# EAGLE design Electromiografo (EAGLE 9.6.2)
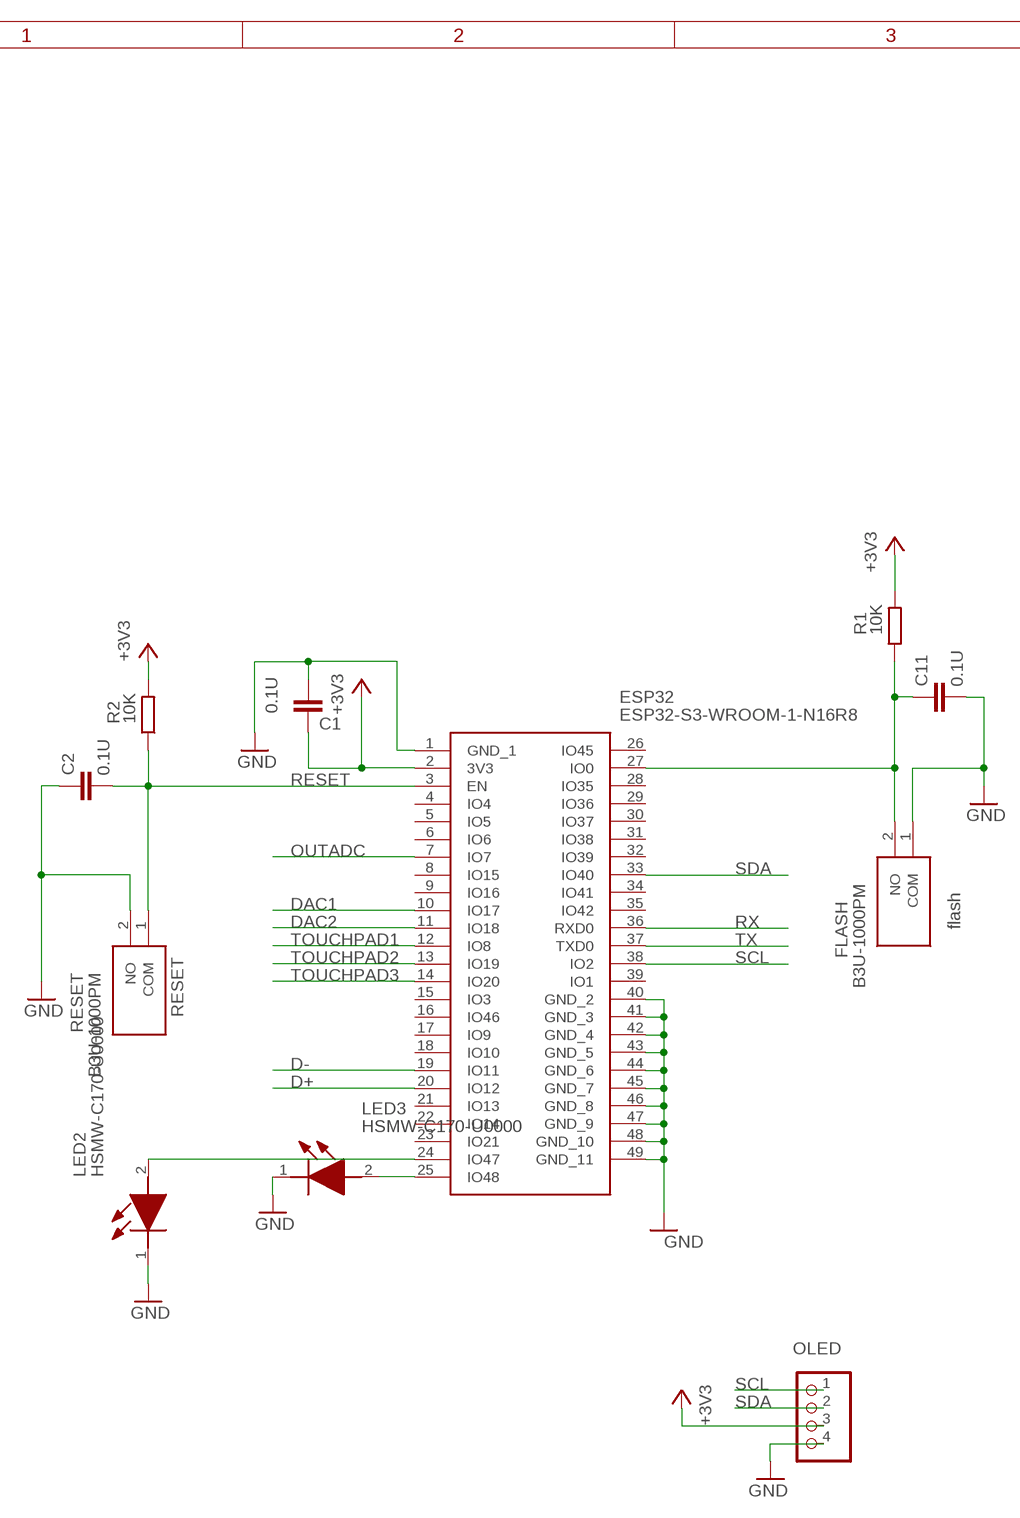
[diagram p0: schematic, sheet 1, part 1 of 2]
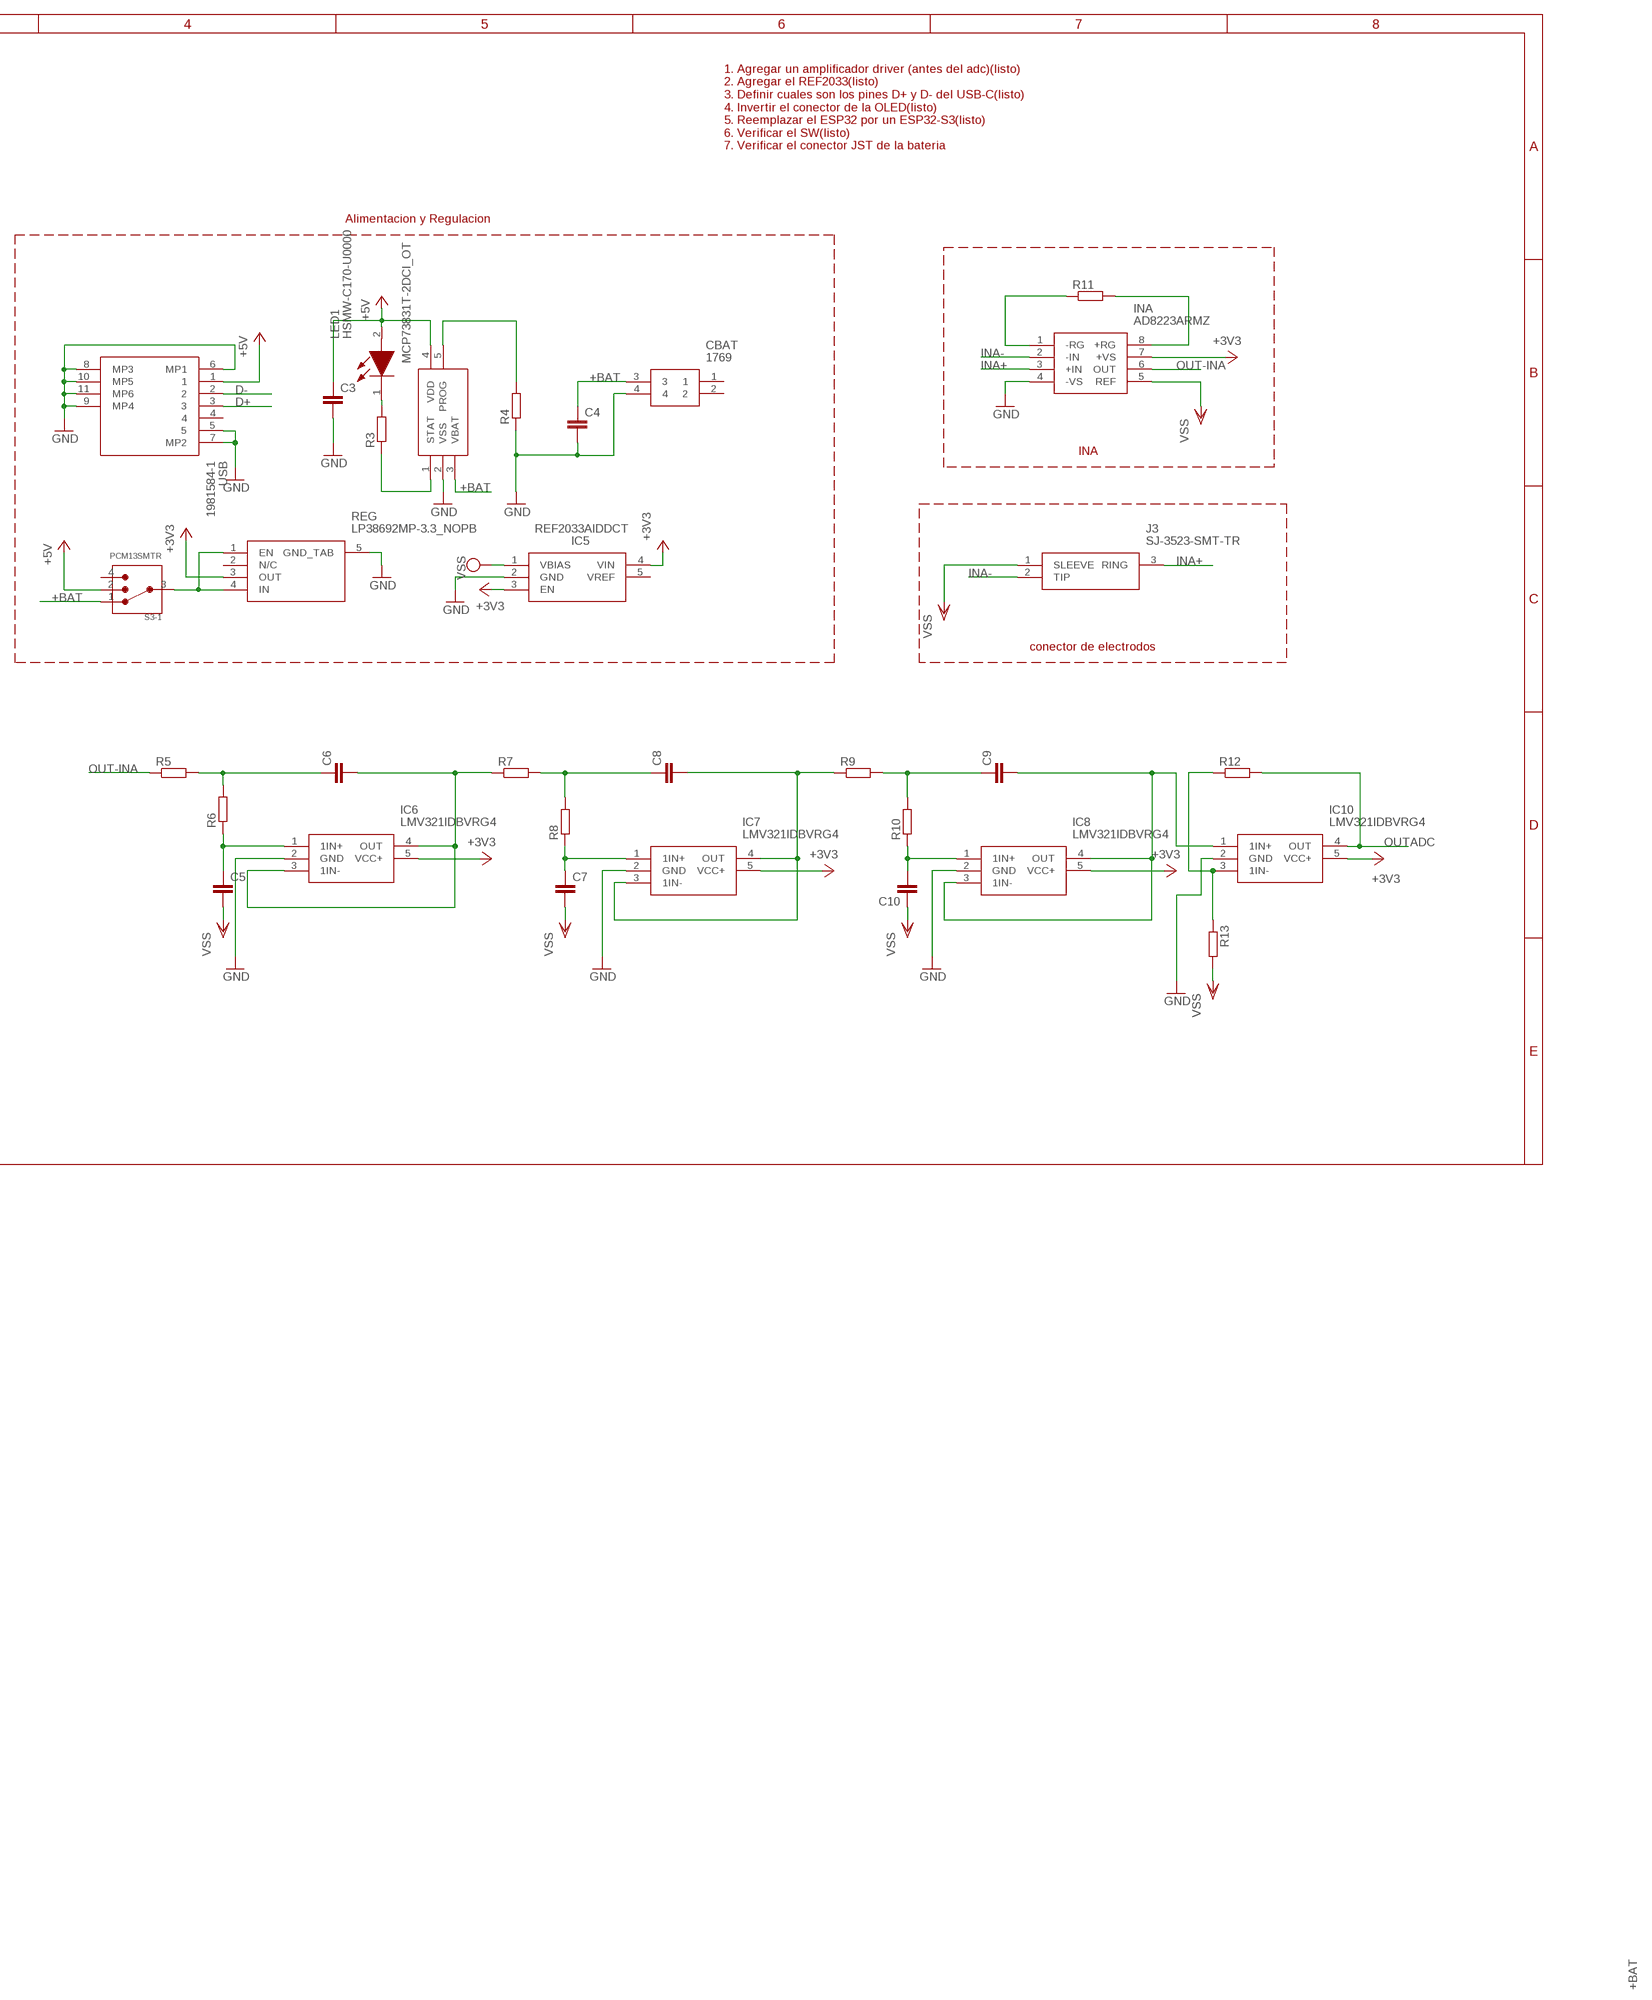
[diagram p1: schematic, sheet 1, part 2 of 2]

## Parts
C1  0.1U  C-EUC0603  [C0603]
C2  0.1U  C-EUC0603  [C0603]
C3  C-EUC0805  [C0805]
C4  C-EUC0805  [C0805]
C5  C-EUC0805  [C0805]
C6  C-EUC0805  [C0805]
C7  C-EUC0805  [C0805]
C8  C-EUC0805  [C0805]
C9  C-EUC0805  [C0805]
C10  C-EUC0805  [C0805]
C11  0.1U  C-EUC0603  [C0603]
CBAT  1769  [1769]
ESP32  ESP32-S3-WROOM-1-N16R8  [ESP32S3WROOM1N16R8]
FLASH  B3U-1000PM  [B3U1000PM]
IC2  MCP73831T-2DCI_OT  [SOT95P270X145-5N]
IC5  REF2033AIDDCT  [SOT95P280X110-5N]
IC6  LMV321IDBVRG4  [SOT95P280X145-5N]
IC7  LMV321IDBVRG4  [SOT95P280X145-5N]
IC8  LMV321IDBVRG4  [SOT95P280X145-5N]
IC10  LMV321IDBVRG4  [SOT95P280X145-5N]
INA  AD8223ARMZ  [SOP65P490X110-8N@1]
J3  SJ-3523-SMT-TR  [SJ3523SMTTR]
JP1  PINHD-1X4/90  [1X04/90]
LED1  HSMW-C170-U0000  [LEDC2012X90N]
LED2  HSMW-C170-U0000  [LEDC2012X90N]
LED3  HSMW-C170-U0000  [LEDC2012X90N]
R1  10K  R-EU_R0805  [R0805]
R2  10K  R-EU_R0805  [R0805]
R3  R-EU_R0805  [R0805]
R4  R-EU_R0805  [R0805]
R5  R-EU_R0805  [R0805]
R6  R-EU_R0805  [R0805]
R7  R-EU_R0805  [R0805]
R8  R-EU_R0805  [R0805]
R9  R-EU_R0805  [R0805]
R10  R-EU_R0805  [R0805]
R11  R-EU_R0805  [R0805]
R12  R-EU_R0805  [R0805]
R13  R-EU_R0805  [R0805]
REG  LP38692MP-3.3_NOPB  [SOT150P700X180-5N]
RESET  B3U-1000PM  [B3U1000PM]
S3-1  PCM13SMTR  [SW_PCM13SMTR]
USB  1981584-1  [19815841]

## Nets
+3V3: C1.2 ESP32.2(3V3) IC5.4(VIN) IC6.5(VCC+) IC7.5(VCC+) IC8.5(VCC+) IC10.5(VCC+) INA.7(+VS) JP1.3 R1.2 R2.2 REG.3(OUT)
+5V: C3.1 IC2.4(VDD) LED1.2(A) S3-1.2 USB.1
+BAT: C4.1 CBAT.3 IC2.3(VBAT) S3-1.1
D+: ESP32.20(IO12) USB.3
D-: ESP32.19(IO11) USB.2
DAC1: ESP32.10(IO17)
DAC2: ESP32.11(IO18)
GND: C1.1 C2.1 C3.2 C4.2 C11.2 CBAT.4 ESP32.1(GND_1) ESP32.40(GND_2) ESP32.41(GND_3) ESP32.42(GND_4) ESP32.43(GND_5) ESP32.44(GND_6) ESP32.45(GND_7) ESP32.46(GND_8) ESP32.47(GND_9) ESP32.48(GND_10) ESP32.49(GND_11) FLASH.1(COM) IC2.2(VSS) IC5.2(GND) IC6.2(GND) IC7.2(GND) IC8.2(GND) IC10.2(GND) INA.4(-VS) JP1.4 LED2.1(K) LED3.1(K) R4.1 REG.5(GND_TAB) RESET.2(NO) USB.5 USB.6(MP1) USB.7(MP2) USB.8(MP3) USB.9(MP4) USB.10(MP5) USB.11(MP6)
INA+: INA.3(+IN) J3.3(RING)
INA-: INA.2(-IN) J3.2(TIP)
N$1: C11.1 ESP32.27(IO0) FLASH.2(NO) R1.1
N$2: LED1.1(K) R3.2
N$3: ESP32.25(IO48) LED3.2(A)
N$4: ESP32.24(IO47) LED2.2(A)
N$5: IC5.3(EN) ; supply symbol labelled +3V3
N$17: IC10.3(1IN-) R12.1 R13.1
N$24: IC2.1(STAT) R3.1
N$25: IC2.5(PROG) R4.2
N$26: REG.1(EN) REG.4(IN) S3-1.3
N$30: C6.2 IC6.3(1IN-) IC6.4(OUT) R7.1
N$31: C6.1 R5.2 R6.2
N$32: C5.1 IC6.1(1IN+) R6.1
N$33: C9.1 R9.2 R10.2
N$34: C7.1 IC7.1(1IN+) R8.1
N$35: C8.1 R7.2 R8.2
N$36: C8.2 IC7.3(1IN-) IC7.4(OUT) R9.1
N$37: C10.2 IC8.1(1IN+) R10.1
N$38: C9.2 IC8.3(1IN-) IC8.4(OUT) IC10.1(1IN+)
N$40: INA.8(+RG) R11.2
N$41: INA.1(-RG) R11.1
OUT-INA: INA.6(OUT) R5.1
OUTADC: ESP32.7(IO7) IC10.4(OUT) R12.2
RESET: C2.2 ESP32.3(EN) R2.1 RESET.1(COM)
RX: ESP32.36(RXD0)
SCL: ESP32.38(IO2) JP1.1
SDA: ESP32.33(IO40) JP1.2
TOUCHPAD1: ESP32.12(IO8)
TOUCHPAD2: ESP32.13(IO19)
TOUCHPAD3: ESP32.14(IO20)
TX: ESP32.37(TXD0)
VSS: C5.2 C7.2 C10.1 IC5.1(VBIAS) INA.5(REF) J3.1(SLEEVE) R13.2
Unconnected: CBAT.1 CBAT.2 ESP32.4(IO4) ESP32.5(IO5) ESP32.6(IO6) ESP32.8(IO15) ESP32.9(IO16) ESP32.15(IO3) ESP32.16(IO46) ESP32.17(IO9) ESP32.18(IO10) ESP32.21(IO13) ESP32.22(IO14) ESP32.23(IO21) ESP32.26(IO45) ESP32.28(IO35) ESP32.29(IO36) ESP32.30(IO37) ESP32.31(IO38) ESP32.32(IO39) ESP32.34(IO41) ESP32.35(IO42) ESP32.39(IO1) IC5.5(VREF) REG.2(N/C) S3-1.4 USB.4

## Notes on the sheet
- 1. Agregar un amplificador driver (antes del adc)(listo)
  2. Agregar el REF2033(listo)
  3. Definir cuales son los pines D+ y D- del USB-C(listo)
  4. Invertir el conector de la OLED(listo)
  5. Reemplazar el ESP32 por un ESP32-S3(listo)
  6. Verificar el SW(listo)
- 7. Verificar el conector JST de la bateria
- Alimentacion y Regulacion
- INA
- flash
- conector de electrodos
- RESET
- OLED

## Library data of the parts
C1-C11 = rcl:C-EU: CAPACITOR, European symbol; SPICEPREFIX: C
CBAT = SamacSys_Parts:1769: Adafruit Accessories JST-PH 2-pin SMT Right Angle Connect Source: Datasheet <https://cdn-shop.adafruit.com/datasheets/17311.pdf>; DESCRIPTION: Adafruit Accessories JST-PH 2-pin SMT Right Angle Connect; HEIGHT: 5.5mm; MANUFACTURER_NAME: Adafruit; MANUFACTURER_PART_NUMBER: 1769; MOUSER_PART_NUMBER: 485-1769; MOUSER_PRICE-STOCK: https://www.mouser.co.uk/ProductDetail/Adafruit/1769?qs=GURawfaeGuBbgoGtf2XstA%3D%3D
ESP32 = SamacSys_Parts:ESP32-S3-WROOM-1-N16R8: Multiprotocol Modules SMD Module, ESP32-S3R8, 3.3V, 8 MB Octal PSRAM Die, 16 MB Quad SPI Flash, PCB Antenna Source: Datasheet <https://www.espressif.com/sites/default/files/documentation/esp32-s3-wroom-1_wroom-1u_datasheet_en.pdf>; DESCRIPTION: Multiprotocol Modules SMD Module, ESP32-S3R8, 3.3V, 8 MB Octal PSRAM Die, 16 MB Quad SPI Flash, PCB Antenna; HEIGHT: 3.25mm; MANUFACTURER_NAME: Espressif Systems; MANUFACTURER_PART_NUMBER: ESP32-S3-WROOM-1-N16R8; MOUSER_PART_NUMBER: 356-ESP32S3WRM1N16R8; MOUSER_PRICE-STOCK: https://www.mouser.co.uk/ProductDetail/Espressif-Systems/ESP32-S3-WROOM-1-N16R8?qs=Li%252BoUPsLEnvQc9gW6AMhZg%3D%3D
FLASH RESET = SamacSys_Parts:B3U-1000PM: SWITCH TACTILE SPST-NO 0.05A 12V, Tactile Switch SPST-NO Top Actuated Surface Mount Source: Datasheet <https://omronfs.omron.com/en_US/ecb/products/pdf/en-b3u.pdf>; DESCRIPTION: SWITCH TACTILE SPST-NO 0.05A 12V, Tactile Switch SPST-NO Top Actuated Surface Mount; HEIGHT: 1.75mm; MANUFACTURER_NAME: OMRON Electronic Components LLC; MANUFACTURER_PART_NUMBER: B3U-1000PM; MOUSER_PART_NUMBER: 653-B3U-1000PM; MOUSER_PRICE-STOCK: https://www.mouser.co.uk/ProductDetail/Omron-Electronics/B3U-1000PM?qs=hnUcNC2tU0oiJUWqjOlHqA%3D%3D
IC2 = SamacSys_Parts:MCP73831T-2DCI_OT: Charge Controller Li-Ion/Li-Pol Source: Datasheet <http://ww1.microchip.com/downloads/en/DeviceDoc/20001984g.pdf>; DESCRIPTION: Charge Controller Li-Ion/Li-Pol; HEIGHT: 1.45mm; MANUFACTURER_NAME: Microchip; MANUFACTURER_PART_NUMBER: MCP73831T-2DCI/OT; MOUSER_PART_NUMBER: 579-MCP73831T-2DCIOT; MOUSER_PRICE-STOCK: https://www.mouser.co.uk/ProductDetail/Microchip-Technology/MCP73831T-2DCI-OT?qs=yUQqVecv4qu38ml9qkvsJw%3D%3D
IC5 = SamacSys_Parts:REF2033AIDDCT: Low-Drift, Low-Power, Dual-Output VREF and VREF/2 Voltage Reference Source: Datasheet <http://www.ti.com/lit/gpn/ref2033>; DESCRIPTION: Low-Drift, Low-Power, Dual-Output VREF and VREF/2 Voltage Reference; HEIGHT: 1.1mm; MANUFACTURER_NAME: Texas Instruments; MANUFACTURER_PART_NUMBER: REF2033AIDDCT; MOUSER_PART_NUMBER: 595-REF2033AIDDCT; MOUSER_PRICE-STOCK: https://www.mouser.co.uk/ProductDetail/Texas-Instruments/REF2033AIDDCT?qs=7z%252BmIopC6%2FIc00c0wUqUCA%3D%3D
IC6-IC8 IC10 = SamacSys_Parts:LMV321IDBVRG4: Operational Amplifiers - Op Amps Sgl LowVltg Rail-to- Rail Output Op Amp Source: Datasheet <http://www.ti.com/lit/ds/symlink/lmv324.pdf>; DESCRIPTION: Operational Amplifiers - Op Amps Sgl LowVltg Rail-to- Rail Output Op Amp; HEIGHT: 1.45mm; MANUFACTURER_NAME: Texas Instruments; MANUFACTURER_PART_NUMBER: LMV321IDBVRG4; MOUSER_PART_NUMBER: 595-LMV321IDBVRG4; MOUSER_PRICE-STOCK: https://www.mouser.co.uk/ProductDetail/Texas-Instruments/LMV321IDBVRG4?qs=IUbkBnfnSQLdzBvwE%2Fn04A%3D%3D
INA = SamacSys_Parts:AD8223ARMZ: AD8223ARMZ, Instrumention Amplifier, 0.25mV Offset, 80dB CMRR, Rail-Rail Output, 5 to 18V, 8-Pin MSOP Source: Datasheet <https://datasheet.datasheetarchive.com/originals/distributors/Datasheets-SFU1/DSASFU10003811.pdf>; DESCRIPTION: AD8223ARMZ, Instrumention Amplifier, 0.25mV Offset, 80dB CMRR, Rail-Rail Output, 5 to 18V, 8-Pin MSOP; HEIGHT: 1.1mm; MANUFACTURER_NAME: Analog Devices; MANUFACTURER_PART_NUMBER: AD8223ARMZ; MOUSER_PART_NUMBER: 584-AD8223ARMZ; MOUSER_PRICE-STOCK: https://www.mouser.co.uk/ProductDetail/Analog-Devices/AD8223ARMZ?qs=%2FtpEQrCGXCxSDZZGI%252Btj8g%3D%3D
J3 = SamacSys_Parts:SJ-3523-SMT-TR: 3.5 mm, Stereo, Right Angle, Surface Mount (SMT), 3 Conductors, 0 Internal Switches, Audio Jack Connector Source: Datasheet <https://www.sameskydevices.com/product/resource/sj-352x-smt.pdf>; DESCRIPTION: 3.5 mm, Stereo, Right Angle, Surface Mount (SMT), 3 Conductors, 0 Internal Switches, Audio Jack Connector; HEIGHT: 5.2mm; MANUFACTURER_NAME: Same Sky; MANUFACTURER_PART_NUMBER: SJ-3523-SMT-TR; MOUSER_PART_NUMBER: 490-SJ-3523-SMT-TR; MOUSER_PRICE-STOCK: https://www.mouser.co.uk/ProductDetail/CUI-Devices/SJ-3523-SMT-TR?qs=WyjlAZoYn51zOHzJ3r4ZRA%3D%3D
JP1 = pinhead:PINHD-1X4: PIN HEADER
LED1-LED3 = SamacSys_Parts:HSMW-C170-U0000: BROADCOM LIMITED - HSMW-C170-U0000 - LED, WHITE, 670MCD, 0805 Source: Datasheet <https://componentsearchengine.com/Datasheets/2/HSMW-C170-U0000.pdf>; DESCRIPTION: BROADCOM LIMITED - HSMW-C170-U0000 - LED, WHITE, 670MCD, 0805; HEIGHT: 0.9mm; MANUFACTURER_NAME: Avago Technologies; MANUFACTURER_PART_NUMBER: HSMW-C170-U0000; MOUSER_PART_NUMBER: 630-HSMW-C170-U0000; MOUSER_PRICE-STOCK: https://www.mouser.co.uk/ProductDetail/Broadcom-Avago/HSMW-C170-U0000?qs=tMOYG%252Bw4%252BLwGyeHODzQdug%3D%3D
R1-R13 = rcl:R-EU_: RESISTOR, European symbol; SPICEPREFIX: R
REG = SamacSys_Parts:LP38692MP-3.3_NOPB: LP38692MP-3.3/NOPB, Low Dropout Voltage Regulator, 1A, 3.3 V +/-2.5%, 2.7 10 Vin, 5-Pin SOT-223 Source: Datasheet <http://www.ti.com/lit/ds/symlink/lp38692.pdf>; DESCRIPTION: LP38692MP-3.3/NOPB, Low Dropout Voltage Regulator, 1A, 3.3 V +/-2.5%, 2.7 10 Vin, 5-Pin SOT-223; HEIGHT: 1.8mm; MANUFACTURER_NAME: Texas Instruments; MANUFACTURER_PART_NUMBER: LP38692MP-3.3/NOPB; MOUSER_PART_NUMBER: 926-LP38692MP3.3NOPB; MOUSER_PRICE-STOCK: https://www.mouser.co.uk/ProductDetail/Texas-Instruments/LP38692MP-3.3-NOPB?qs=1FNqv8aZn1TpKuOP2NKBdg%3D%3D
S3-1 = PCM13SMTR:PCM13SMTR: Check availability <https://pricing.snapeda.com/parts/PCM13SMTR/C%26K/view-part?ref=eda>; AVAILABILITY: In Stock; CHECK_PRICES: https://www.snapeda.com/parts/PCM13SMTR/C%2526K/view-part/?ref=eda; DESCRIPTION: Slide Switch SP3T Surface Mount, Right Angle; MF: C&K; MP: PCM13SMTR; PACKAGE: None; PRICE: None; SNAPEDA_LINK: https://www.snapeda.com/parts/PCM13SMTR/C%2526K/view-part/?ref=snap
USB = SamacSys_Parts:1981584-1: A/B, 2.0, Micro Profile, Receptacle, 1 Port, Top, Right Angle, Tape & Reel, Offset, Surface Mount, Cable-to-Board, 5 Position, USB Connectors Source: Datasheet <https://www.te.com/commerce/DocumentDelivery/DDEController?Action=srchrtrv&DocNm=1981584&DocType=Customer Drawing&DocLang=English&DocFormat=pdf&PartCntxt=1981584-1>; DESCRIPTION: A/B, 2.0, Micro Profile, Receptacle, 1 Port, Top, Right Angle, Tape & Reel, Offset, Surface Mount, Cable-to-Board, 5 Position, USB Connectors; HEIGHT: 3.2mm; MANUFACTURER_NAME: TE Connectivity; MANUFACTURER_PART_NUMBER: 1981584-1; MOUSER_PART_NUMBER: 571-1981584-1; MOUSER_PRICE-STOCK: https://www.mouser.co.uk/ProductDetail/TE-Connectivity/1981584-1?qs=ozkTL%2FUej0TLYxjQLPnd2Q%3D%3D

## Board
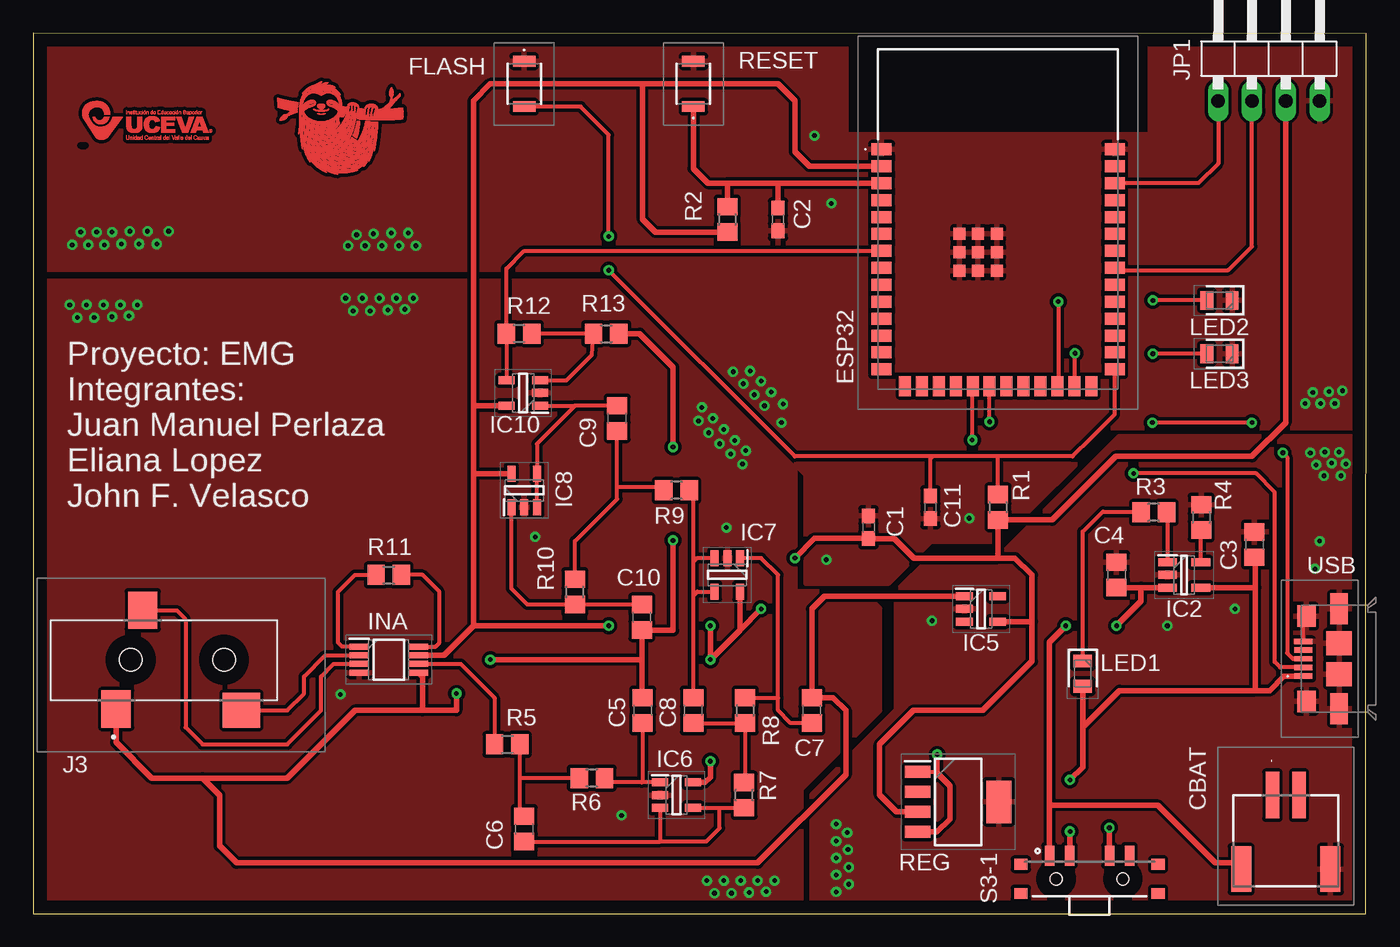
[diagram p2: board, top side]
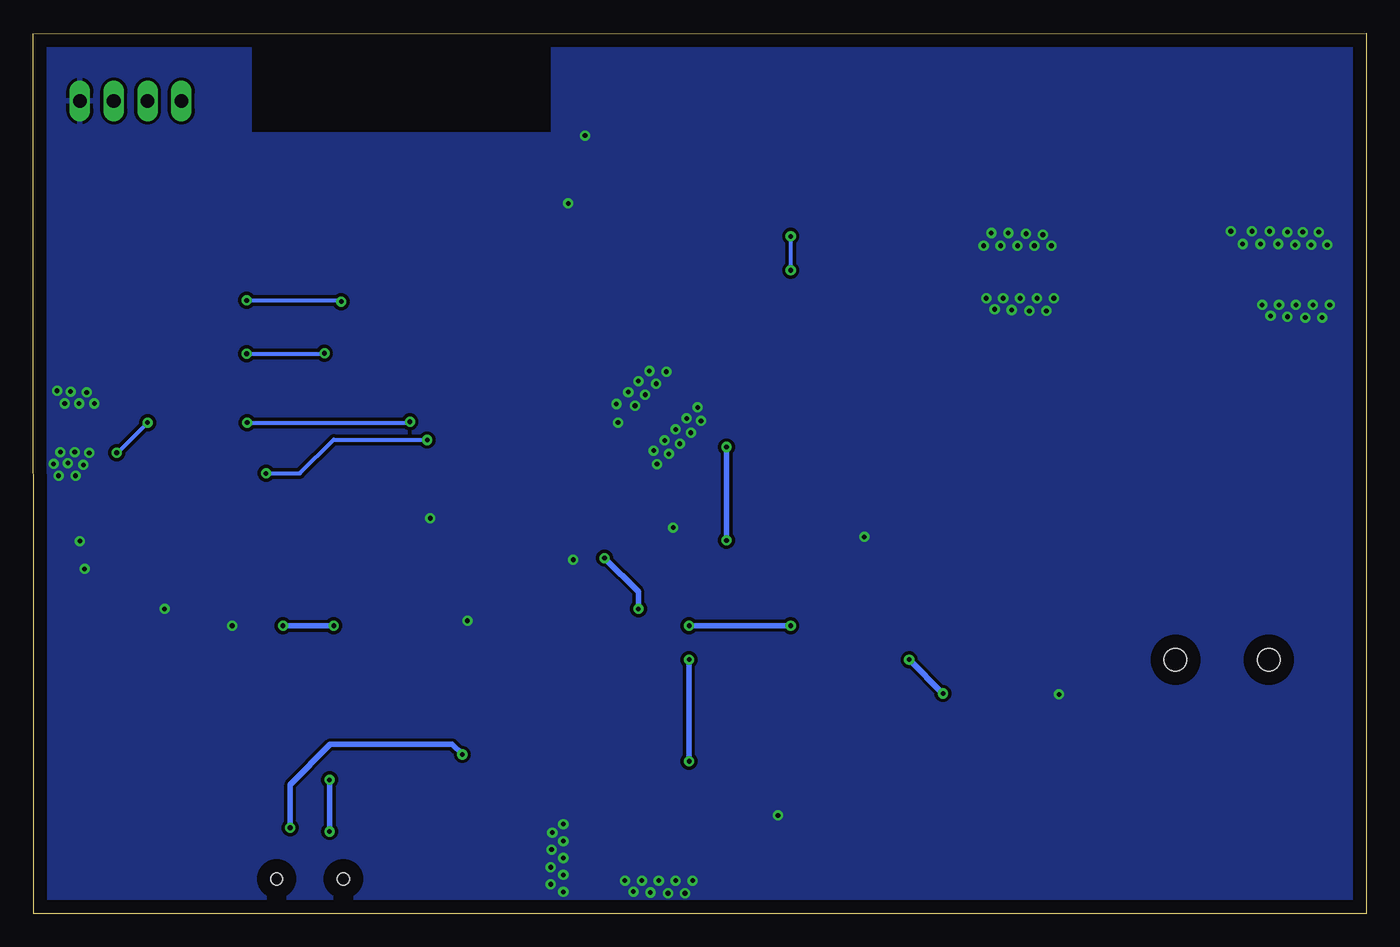
[diagram p3: board, bottom side, seen from below]

Size 100.01 x 66.03 mm. Coordinates in mm from the lower left corner, seen from the top.
Outline: 0,0 99.97,0 100.01,65.99 0,66.03 0,0
Copper layers (1*16): Top 0.035mm / dielectric 1.5mm / Bottom 0.035mm
Design rules "default": minimum track width 6mil, minimum drill 0.35mm, track to track 6mil, track to pad 6mil, pad to pad 6mil, via to via 6mil, smd to smd 6mil, copper to edge 40mil, drill to drill 6mil, minimum pad ring 10mil, minimum via ring 8mil, stop-mask expansion 4mil, vias tented up to drill 0mil, thermal gap 10mil

### Footprints (pad centres in the part's own frame; a part is rotated, then mirrored left to right if it is on the bottom)
C0603 = smd 1.1 x 1: 1 -0.85,0; 2 0.85,0
C0805 = smd 1.3 x 1.5: 1 -0.95,0; 2 0.95,0
1769 = smd 1 x 3.5: 1 -1,0; 2 1,0 | smd 1.5 x 3.4: 3 -3.35,-5.55; 4 3.35,-5.55
ESP32S3WROOM1N16R8 = smd 1.5 x 0.9: 1 -8.75,5.26; 2 -8.75,3.99; 3 -8.75,2.72; 4 -8.75,1.45; 5 -8.75,0.18; 6 -8.75,-1.09; 7 -8.75,-2.36; 8 -8.75,-3.63; 9 -8.75,-4.9; 10 -8.75,-6.17; 11 -8.75,-7.44; 12 -8.75,-8.71; 13 -8.75,-9.98; 14 -8.75,-11.25; 27 8.75,-11.25; 28 8.75,-9.98; 29 8.75,-8.71; 30 8.75,-7.44; 31 8.75,-6.17; 32 8.75,-4.9; 33 8.75,-3.63; 34 8.75,-2.36; 35 8.75,-1.09; 36 8.75,0.18; 37 8.75,1.45; 38 8.75,2.72; 39 8.75,3.99; 40 8.75,5.26 | smd 0.9 x 1.5: 15 -6.985,-12.5; 16 -5.715,-12.5; 17 -4.445,-12.5; 18 -3.175,-12.5; 19 -1.905,-12.5; 20 -0.635,-12.5; 21 0.635,-12.5; 22 1.905,-12.5; 23 3.175,-12.5; 24 4.445,-12.5; 25 5.715,-12.5; 26 6.985,-12.5 | smd 0.9 x 0.9: 41 -1.5,-2.46; 42 -2.9,-1.06; 43 -2.9,-2.46; 44 -2.9,-3.86; 45 -1.5,-3.86; 46 -0.1,-3.86; 47 -0.1,-2.46; 48 -0.1,-1.06; 49 -1.5,-1.06
B3U1000PM = smd 0.8 x 1.7: 1 1.7,0; 2 -1.7,0
SOT95P270X145-5N = smd 1.4 x 0.6: 1 -1.25,0.95; 2 -1.25,0; 3 -1.25,-0.95; 4 1.25,-0.95; 5 1.25,0.95
SOT95P280X110-5N = smd 1.25 x 0.6: 1 -1.25,0.95; 2 -1.25,0; 3 -1.25,-0.95; 4 1.25,-0.95; 5 1.25,0.95
SOT95P280X145-5N = smd 1.2 x 0.6: 1 -1.25,0.95; 2 -1.25,0; 3 -1.25,-0.95; 4 1.25,-0.95; 5 1.25,0.95
SOP65P490X110-8N@1 = smd 1.45 x 0.45: 1 -2.225,0.975; 2 -2.225,0.325; 3 -2.225,-0.325; 4 -2.225,-0.975; 5 2.225,-0.975; 6 2.225,-0.325; 7 2.225,0.325; 8 2.225,0.975
SJ3523SMTTR = smd 2.2 x 2.8: 1 2.4,-3.7; 3 4.4,3.7 | smd 2.8 x 2.6: 2 11.8,-3.8 | hole 1.7: 3.5,0; 10.5,0
1X04/90 = drill 1.016 long: 1 -3.81,-3.81; 2 -1.27,-3.81; 3 1.27,-3.81; 4 3.81,-3.81
LEDC2012X90N = smd 0.95 x 1.4: 1 -0.95,0; 2 0.95,0
R0805 = smd 1.3 x 1.5: 1 -0.95,0; 2 0.95,0
SOT150P700X180-5N = smd 1.9 x 0.9: 1 -3.05,2.25; 2 -3.05,0.75; 3 -3.05,-0.75; 4 -3.05,-2.25 | smd 1.9 x 3.2: 5 3.05,0
SW_PCM13SMTR = smd 0.7 x 1.5: 1 -3,1.75; 2 -1.5,1.75; 3 1.5,1.75; 4 3,1.75 | smd 1 x 0.8: P$1 -5.15,1.1; P$2 -5.15,-1.1; P$3 5.15,1.1; P$4 5.15,-1.1 | hole 0.9: -2.5,0; 2.5,0
19815841 = smd 0.4 x 1.35: 1 -1.3,2.675; 2 -0.65,2.675; 3 0,2.675; 4 0.65,2.675; 5 1.3,2.675 | smd 1.6 x 1.4: 6 -3.2,2.45; 7 3.2,2.45 | smd 2.3 x 1.3: 8 -3.75,0; 11 3.75,0 | smd 1.8 x 1.9: 9 -1.15,0; 10 1.15,0

### Placement (x,y rotation side)
C1  62.67,28.98 270 top
C2  55.88,52.07 90 top
C3  91.63,27.69 90 top
C4  81.28,25.4 90 top
C5  45.72,15.24 90 top
C6  36.83,6.35 270 top
C7  58.42,15.24 90 top
C8  49.53,15.24 90 top
C9  43.8,37.15 90 top
C10  45.66,22.23 90 top
C11  67.31,30.48 270 top
CBAT  93.98,8.89 0 top
ESP32  72.39,52.07 0 top
FLASH  36.83,62.23 90 top
IC2  86.36,25.4 0 top
IC5  71.12,22.86 0 top
IC6  48.26,8.89 0 top
IC7  52.07,25.4 270 top
IC8  36.83,31.75 90 top
IC10  36.77,39.05 180 top
INA  26.67,19.05 0 top
J3  3.81,19.05 0 top
JP1  92.71,64.77 0 top
LED1  78.75,18 270 top
LED2  89,46 180 top
LED3  89,42 180 top
R1  72.39,30.48 270 top
R2  52.07,52.07 270 top
R3  84.07,30.1 180 top
R4  87.63,29.72 270 top
R5  35.56,12.7 0 top
R6  41.91,10.16 180 top
R7  53.34,8.89 90 top
R8  53.4,15.24 270 top
R9  48.26,31.75 180 top
R10  40.64,24.13 90 top
R11  26.67,25.4 0 top
R12  36.45,43.5 180 top
R13  42.99,43.5 0 top
REG  69.41,8.38 0 top
RESET  49.53,62.23 270 top
S3-1  79.25,2.6 0 top
USB  97.98,19.11 90 top

### Tracks (layer width: path | path; a pad name or v marks a point on that pad's centre or on a via)
+3V3  (via drill 0.35)
  Top 0.305: R1.2
  Top 0.406: INA.7 30.8,19.38 33.02,21.59 | 33.02,21.59 33.02,33.02 | 33.02,33.02 33.02,38.1 | IC5.4 74.93,21.91 | REG.3 64.77,7.63 63.5,8.9 63.5,12.7 66.04,15.24 71.25,15.24 74.93,18.92 74.93,21.91 | ESP32.2 62.05,56.06 58.67,56.07 58.23,56.07 57.15,57.15 57.15,60.96 55.88,62.23 45.72,62.23 | 45.72,62.23 34.29,62.23 33.02,60.96 33.02,38.1 | R2.2 46.67,51.12 45.72,52.07 45.72,62.23 | IC6.5 50.4,9.84 50.8,10.24 v50.8,11.43 | 53.02,21.27 v50.8,19.05 v50.8,21.59 | 53.02,21.27 v54.61,22.86 | IC7.5 53.02,21.27 | v57.15,26.67 58.63,28.15 62.65,28.15 C1.2 64.61,28.13 66.07,26.67 72.39,26.67 | 74.93,21.91 74.93,25.4 73.66,26.67 72.39,26.67 | R1.2 72.39,26.67 | IC8.5 33.04,33 33.02,33.02 | JP1.3 93.98,36.83 91.44,34.29 81.22,34.29 76.45,29.53 R1.2 | 33.02,21.59 v43.18,21.59 | 33.02,38.1 IC10.5
  Bottom 0.406: v50.8,11.43 v50.8,19.05 | v54.61,22.86 54.61,24.13 v57.15,26.67 | v43.18,21.59 v50.8,21.59
+5V  (via drill 0.35)
  Top 0.406: USB.1 93.84,17.81 92.76,16.73 91.66,16.73 | v77.78,10.04 78.74,10.99 78.74,13.97 | 78.74,13.97 81.5,16.73 91.66,16.73 | 91.69,24.45 91.69,16.76 91.66,16.73 | v77.79,6.16 77.79,4.39 S3-1.2 | IC2.4 91.69,24.45 | C3.1 91.69,26.67 91.69,24.45 | 78.74,13.97 LED1.2
  Bottom 0.406: v77.78,10.04 v77.78,6.16 v77.79,6.16
+BAT  (via drill 0.35)
  Top 0.305: IC2.3 85.59,24.45
  Top 0.406: C4.1 83.12,24.45 | 83.12,24.45 IC2.3 | 76.25,8.14 76.25,20.37 v77.47,21.59 | 90.16,3.81 90.17,3.81 | 90.17,3.81 CBAT.3 | 90.17,3.81 88.71,3.81 84.39,8.13 76.26,8.13 76.25,8.14 | 76.25,8.14 S3-1.1 | 83.12,24.45 83.12,23.43 v81.28,21.59
  Bottom 0.406: v81.28,21.59 v77.47,21.59
D+  (via drill 0.35)
  Top 0.305: v93.76,34.58 94.09,34.24 94.09,19.54 94.52,19.11 USB.3 | v91.44,36.83 v83.96,36.83 | v71.75,36.89 ESP32.20
  Bottom 0.305: v93.76,34.58 93.69,34.58 v91.44,36.83 | v83.96,36.83 71.82,36.83 v71.75,36.89
D-  (via drill 0.35)
  Top 0.305: USB.2 93.57,18.46 93.15,18.88 93.15,31.62 91.76,33.02 v82.55,33.02 | v70.45,35.53 70.45,39.54 ESP32.19
  Bottom 0.305: v82.55,33.02 80.01,33.02 77.47,35.56 70.55,35.56 70.48,35.5 v70.45,35.53
GND  (via drill 0.35)
  Top 0.152: ESP32.40 80.96,57.15
  Top 0.305: 95.35,20.46 USB.5 95.31,22.09 USB.7
  other vias: 85.09,21.59 90.17,22.86 67.44,21.97 70.23,29.65 59.5,26.54 52.01,28.96 44.13,7.37 37.66,28.26 23.05,16.45 2.73,45.66 4,45.66 5.27,45.66 6.54,45.66 7.81,45.66 3.3,44.7 4.57,44.7 5.91,44.77 7.18,44.83 59.88,53.28 58.61,58.36 96.52,27.94 3.56,51.12 4.76,51.12 5.91,51.12 7.24,51.18 8.57,51.18 10.16,51.18 9.27,50.23 7.94,50.23 6.6,50.23 5.33,50.16 4.13,50.16 2.92,50.16 50.16,37.97 50.99,37.15 51.82,36.32 52.64,35.5 53.47,34.73 49.91,36.96 50.67,36.07 51.5,35.24 52.32,34.48 53.21,33.72 52.51,40.64 53.28,39.75 54.1,38.93 54.86,38.1 56.13,36.83 53.78,40.7 54.61,39.94 55.37,39.12 56.26,38.23 95.44,38.27 96.58,38.27 97.66,38.27 96.01,39.09 97.21,39.16 98.23,39.22 95.82,34.56 96.91,34.62 97.99,34.62 96.26,33.66 97.42,33.79 98.49,33.73 96.84,32.84 98.11,32.84 23.43,46.16 24.7,46.16 25.97,46.16 27.24,46.16 28.51,46.16 24,45.21 25.27,45.21 26.61,45.28 27.88,45.34 28.7,50.1 27.43,50.1 26.16,50.1 24.89,50.1 23.62,50.1 28.13,51.05 26.86,51.05 25.53,50.99 24.26,50.93 60.24,1.63 60.24,2.9 60.24,4.17 60.24,5.44 60.24,6.71 61.2,2.2 61.2,3.47 61.13,4.81 61.07,6.08 50.54,2.48 51.81,2.48 53.08,2.48 54.35,2.48 55.62,2.48 51.11,1.52 52.38,1.52 53.72,1.59 54.99,1.65 96.17,25.86
  pour Top (isolate 0.254): 99.95,36.46 99.95,65.99 83.82,65.99 83.82,58.42 60.96,58.42 60.96,66.04 0,66.04 0,48.34 42.59,48.34 57.98,32.96 57.98,24.77 64.14,24.77 67.31,27.94 72.39,27.94 80.91,36.46
  pour Top (isolate 0.254): 0,47.44 43.04,47.44 57.15,33.34 57.15,24.13 62.23,24.13 63.5,22.86 63.5,15.24 57.62,9.36 57.62,0 0,0
  pour Top (isolate 0.254): 81.5,35.78 100.33,35.78 100.33,0 58.42,0 58.42,8.89 64.77,15.24 64.77,24.13 67.31,26.67 72.39,26.67
  pour Bottom (isolate 0.254): 0,66.04 60.96,66.04 60.96,58.42 83.82,58.42 83.82,65.98 99.89,65.98 99.89,-0.05 0,-0.05
INA+
  Top 0.305: J3.3 10.75,22.75 11.43,22.07 11.43,13.97 12.7,12.7 19.05,12.7 21.59,15.24 21.59,17.78 22.54,18.73 INA.3
INA-
  Top 0.305: J3.2 19.04,15.25 19.06,15.25 20.32,16.51 20.32,17.78 21.91,19.38 INA.2
N$1  (via drill 0.35)
  Top 0.305: R1.1 72.39,34.29 | C11.1 67.31,34.12 67.48,34.29 | 72.39,34.29 77.98,34.29 79.34,35.66 79.38,35.69 81.14,37.45 ESP32.27 | 72.39,34.29 67.48,34.29 | 67.48,34.29 57.15,34.29 v43.18,48.26 | v43.18,50.8 43.18,58.42 41.07,60.53 FLASH.2
  Bottom 0.305: v43.18,48.26 v43.18,50.8
N$2
  Top 0.305: LED1.1 78.75,23 78.75,23.31 78.75,28.64 80.26,30.16 83.06,30.16
  Top 0.406: 83.06,30.16 R3.2
N$3  (via drill 0.35)
  Top 0.305: LED3.2 v84,42 | v78.17,42.04 78.11,41.97 ESP32.25
  Bottom 0.305: v84,42 78.21,42 v78.17,42.04
N$4  (via drill 0.35)
  Top 0.305: LED2.2 v84,46 | v76.9,45.9 76.9,39.64 ESP32.24
  Bottom 0.305: v84,46 76.99,46 v76.9,45.91 v76.9,45.9
N$17
  Top 0.305: R13.1 41.59,43.18 | R13.1 R12.1 | IC10.3 40,40 41.91,41.91 R13.1
N$24
  Top 0.305: IC2.1 85.09,26.37 85.09,30.03 R3.1
N$25
  Top 0.305: IC2.5 87.61,28.75 R4.2
N$26  (via drill 0.35)
  Top 0.305: REG.1 67.73,10.63
  Top 0.406: REG.4 67.82,6.13 68.77,7.08 68.77,9.59 67.73,10.63 67.82,10.72 v67.82,11.94 | S3-1.3 80.75,6.39 80.77,6.41 v80.74,6.45
  Bottom 0.406: v80.74,6.45 80.74,9.68 77.72,12.7 68.58,12.7 v67.82,11.94
N$30
  Top 0.305: 49.53,7.92 IC6.4 51.5,7.94 | 47.01,5.4 50.48,5.4 51.5,6.41 51.5,7.94 | 37.15,5.08 C6.2 47.01,5.4 | IC6.3 47.01,5.4 | 51.5,7.94 R7.1
N$31
  Top 0.305: C6.1 36.51,7.62 36.51,10.16 | 36.51,10.16 R5.2 | R6.2 36.51,10.16
N$32
  Top 0.305: IC6.1 45.66,9.84 | 45.66,9.84 43.18,9.84 R6.1 | C5.1 45.72,9.9 45.66,9.84
N$33
  Top 0.305: R10.2 40.64,27.94 43.8,31.1 43.8,32 | 43.8,32 C9.1 | R9.2 47.06,32 43.8,32
N$34
  Top 0.305: 55.88,16.19 55.88,25.4 54.61,26.67 53.04,26.67 IC7.1 | C7.1 56.83,14.29 55.88,15.24 55.88,16.19 | R8.1 55.88,16.19
N$35
  Top 0.305: R7.2 53.4,9.9 R8.2 C8.1 49.85,13.97
N$36
  Top 0.305: C8.2 49.53,23.86 | IC7.4 49.82,24.15 49.53,23.86 | IC7.3 49.78,26.65 49.53,26.4 | 49.53,23.86 49.53,26.4 | 49.53,26.4 49.53,31.43 R9.1
N$37
  Top 0.305: C10.2 44.45,23.18 44.39,23.18 R10.1 37.08,23.18 35.88,24.38 IC8.1
N$38
  Top 0.305: IC8.3 IC8.4 37.78,35.24 40.64,38.1 | 40.64,38.1 C9.2 | 40.64,38.1 | IC10.1 40.64,38.1
N$40
  Top 0.305: INA.8 30.18,20.02 30.48,20.32 30.48,24.13 29.21,25.4 R11.2
N$41
  Top 0.305: INA.1 23.16,20.02 22.86,20.32 22.86,24.13 24.13,25.4 R11.1
OUT-INA
  Top 0.305: INA.6 32.08,18.73 34.61,16.19 R5.1
OUTADC
  Top 0.305: ESP32.7 36.83,49.71 35.5,48.38 R12.2 35.52,43.48 IC10.4
RESET
  Top 0.406: ESP32.3 55.88,54.8 | 55.88,54.8 C2.2 | RESET.1 49.53,55.88 50.61,54.8 52.07,54.8 | 52.07,54.8 R2.1 | 55.88,54.8 52.07,54.8
SCL
  Top 0.305: ESP32.38 87.43,54.79 88.9,56.26 JP1.1
SDA
  Top 0.305: ESP32.33 81.32,48.26 89.66,48.26 91.44,50.04 JP1.2
VSS  (via drill 0.35)
  Top 0.406: J3.1 6.21,12.84 8.89,10.16 12.7,10.16 | 12.7,10.16 19.05,10.16 24.13,15.24 29.21,15.24 | 29.21,15.24 29.21,17.78 28.91,18.07 INA.5 | 45.66,19.05 C10.1 45.68,21.25 48,21.25 v48,28 | 45.66,19.05 45.66,16.25 C5.2 | 12.7,10.16 13.97,8.89 13.97,5.08 15.24,3.81 54.36,3.81 60.96,10.41 60.96,15.24 60.01,16.19 C7.2 58.42,22.86 59.37,23.81 IC5.1 | 45.66,19.05 v34.29,19.05 | v31.75,16.51 31.75,15.24 29.21,15.24 | R13.2 45.5,43.5 48,41 v48,35
  Bottom 0.406: v34.29,19.05 v31.75,16.51 | v48,35 v48,28
(copper drawn outside any net)
  shapes: Top area x9639

### Text on the board
Top: C:/Users/cabin/Downloads/Logo-Uceva.bmp
tPlace: Proyecto: EMG / Integrantes: / Juan Manuel Perlaza / Eliana Lopez / John F. Velasco
201bmp: C:/Users/cabin/Downloads/Logo-Perezoso.bmp